# EAGLE design wcdl (EAGLE 9.6.2)
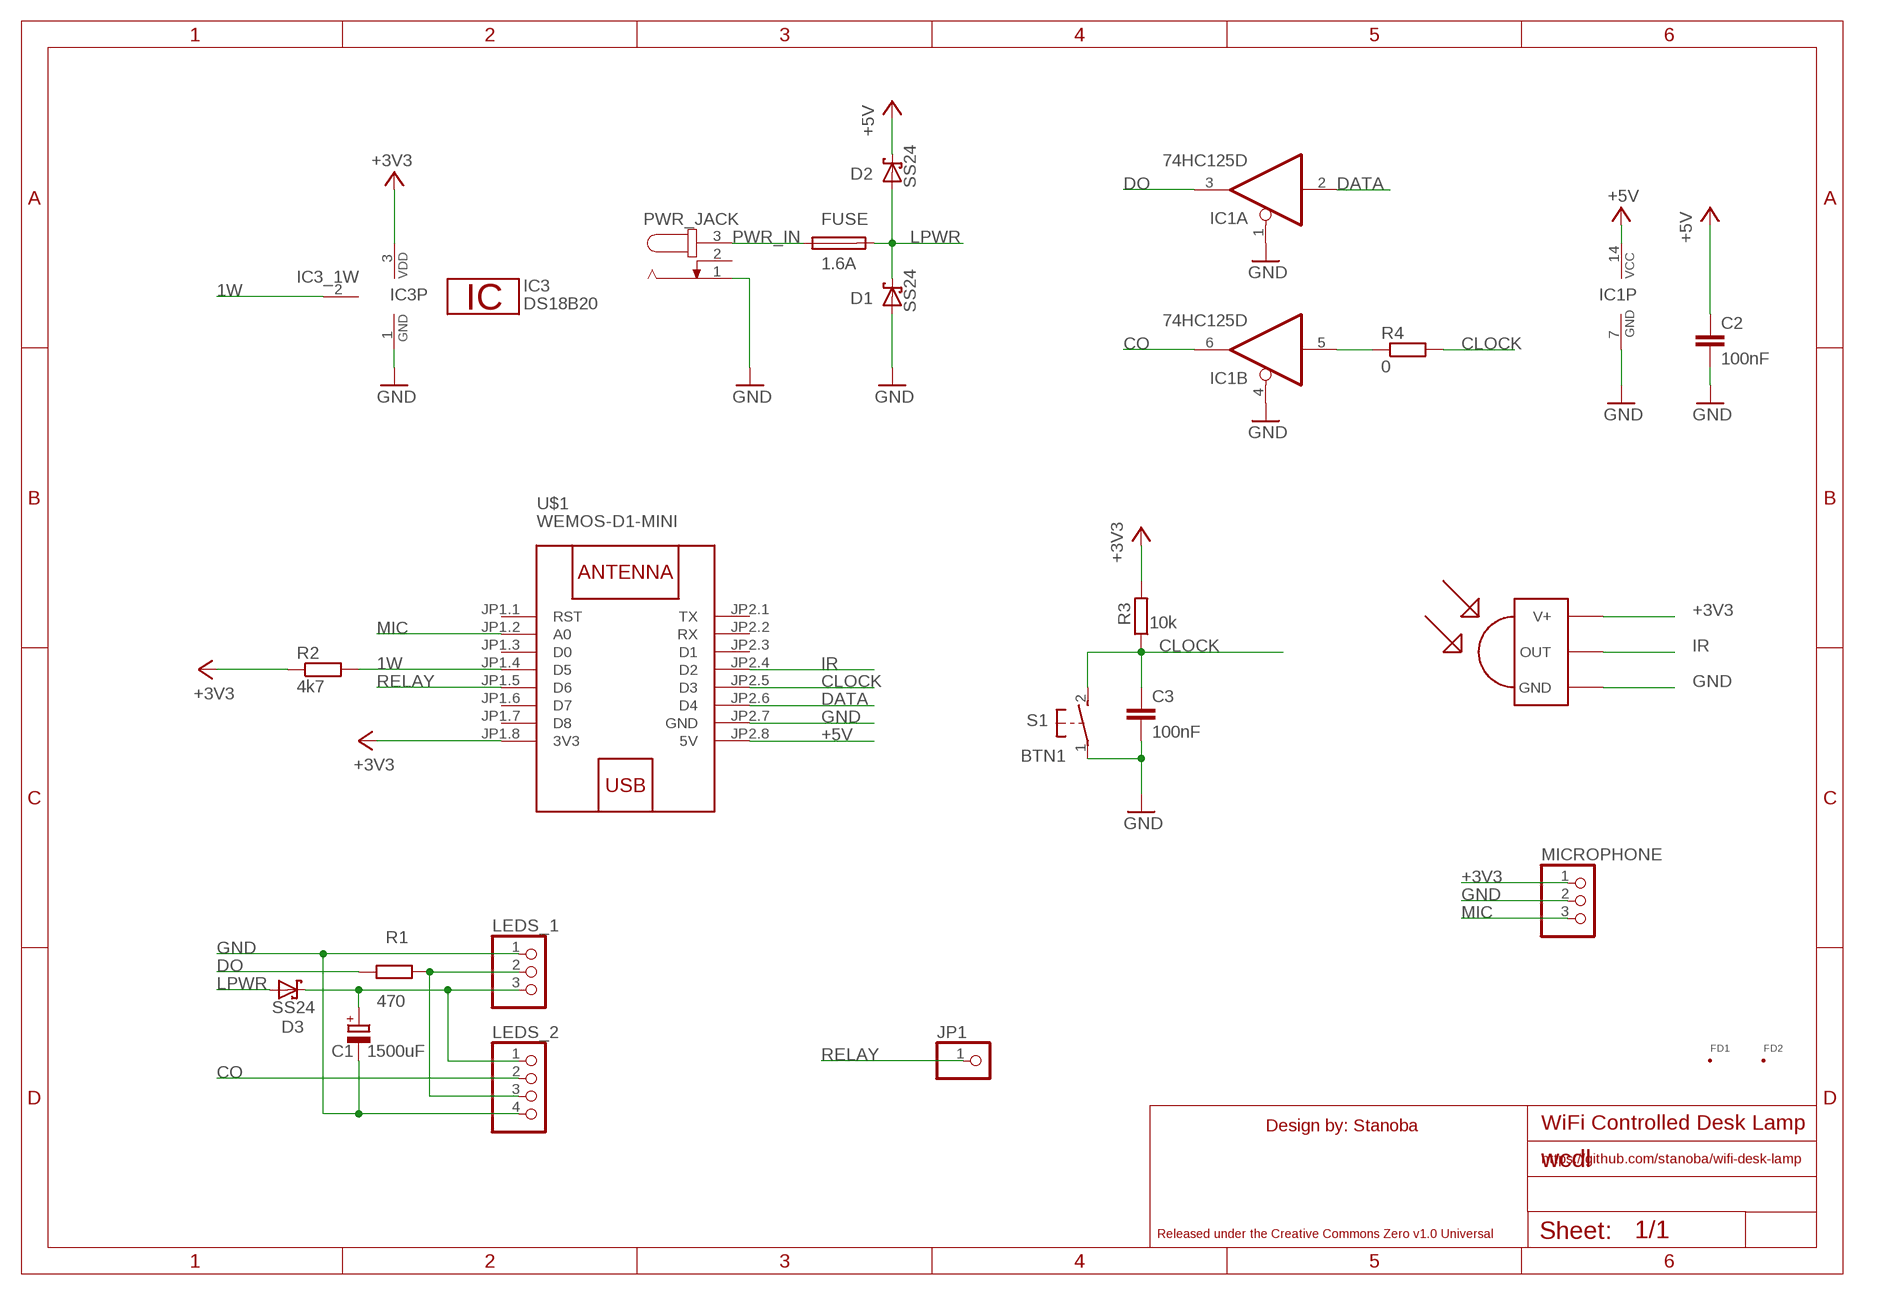
[diagram p0: schematic, sheet 1]

## Parts
C1  1500uF  CPOL-EUG  [PANASONIC_G]
C2  100nF  C-EUC0603  [C0603]
C3  100nF  C-EUC0603  [C0603]
D1  SS24  SCHOTTKY-DIODESMD  [SMB]
D2  SS24  SCHOTTKY-DIODESMD  [SMB]
D3  SS24  SCHOTTKY-DIODESMD  [SMB]
FD1  FID_40MIL  [FID_040]
FD2  FID_40MIL  [FID_040]
FUSE  1.6A  FUSESHK20L  [SHK20L]
IC1  74HC125D  [SO14]
IC3  DS18B20  [TO92-]
JP1  PINHD-1X1  [1X01]
LEDS_1  PINHD-1X3  [1X03]
LEDS_2  PINHD-1X4  [1X04]
MICROPHONE  PINHD-1X3  [1X03]
PWR_JACK  JACK-PLUG0  [SPC4077]
R1  470  R-EU_R0603  [R0603]
R2  4k7  R-EU_R0603  [R0603]
R3  10k  R-EU_R0603  [R0603]
R4  0  R-EU_R0402  [R0402]
S1  BTN1  31-XX  [B3F-31XX]
U$1  WEMOS-D1-MINI  [WEMOS-D1-MINI]
U$2  TSOP1838  [TSOP18XX]

## Nets
1W: IC3.2 R2.2 U$1.JP1.4(D5)
+3V3 [mid]: IC3.3 MICROPHONE.1 R2.1 R3.2 U$1.JP1.8(3V3) U$2.VCC(V+)
+5V [mid]: C2.1 D2.C IC1.14(P:VCC) U$1.JP2.8(5V)
CLOCK: C3.1 R3.1 R4.2 S1.2(S) U$1.JP2.5(D3)
CO: IC1.6(B:O) LEDS_2.2
DATA: IC1.2(A:I) U$1.JP2.6(D4)
DO: IC1.3(A:O) R1.1
GND [power]: C1.- C2.2 C3.2 D1.A IC1.1(A:OE) IC1.4(B:OE) IC1.7(P:GND) IC3.1 LEDS_1.1 LEDS_2.4 MICROPHONE.2 PWR_JACK.1 S1.1(P) U$1.JP2.7(GND) U$2.GND
IR: U$1.JP2.4(D2) U$2.OUT
LPWR [power]: D1.C D2.A D3.A FUSE.2A
MIC: MICROPHONE.3 U$1.JP1.2(A0)
N$1 [power]: C1.+ D3.C LEDS_1.3 LEDS_2.1
N$2: LEDS_1.2 LEDS_2.3 R1.2
N$3: IC1.5(B:I) R4.1
PWR_IN [power]: FUSE.1A PWR_JACK.3
RELAY: JP1.1 U$1.JP1.5(D6)
Unconnected: IC1.8(C:O) IC1.9(C:I) IC1.10(C:OE) IC1.11(D:O) IC1.12(D:I) IC1.13(D:OE) PWR_JACK.2 U$1.JP1.1(RST) U$1.JP1.3(D0) U$1.JP1.6(D7) U$1.JP1.7(D8) U$1.JP2.1(TX) U$1.JP2.2(RX) U$1.JP2.3(D1)

## Notes on the sheet
- Design by: Stanoba | WiFi Controlled Desk Lamp
- https://github.com/stanoba/wifi-desk-lamp
- Released under the Creative Commons Zero v1.0 Universal

## Library data of the parts
C1 = rcl:CPOL-EU: POLARIZED CAPACITOR, European symbol; SPICEPREFIX: C
C2 C3 = rcl:C-EU: CAPACITOR, European symbol; SPICEPREFIX: C
D1-D3 = _mod_diode:SCHOTTKY-DIODE: Schottky Diode
FD1 FD2 = Fiducial:FID: Fiducial marks. Top and Bottom copper with stop mask
FUSE = fuse:FUSE: Fuse; OC_FARNELL: unknown; OC_NEWARK: unknown
IC1 = 74xx-eu:74*125: Quad bus BUFFER, 3-state
IC3 = 1wire:DS18B20: Programmable Resolution Digital Thermometer This chip provides a onewire thermosensor with approx. 0.5°C accuracy. A programmable over/undertemperure alarm is available. The precision can be set from 9..12 bits. Notes: Vdd must be applied for accurate measurements at low temperatures, as the parasite power circuit otherwise heats the sensor. If parasite power is used, Vdd has to be connected to GND. The DS1822 is a low-cost thermometer chip, the DS18S20 is similar to the DS18B20, but with 9 Bit precision only. Author: Jan Kandziora <jjj@gmx.de>
JP1 = pinhead:PINHD-1X1: PIN HEADER
LEDS_1 MICROPHONE = pinhead:PINHD-1X3: PIN HEADER
LEDS_2 = pinhead:PINHD-1X4: PIN HEADER
PWR_JACK = con-jack:JACK-PLUG: DC POWER JACK Power Jack, DC, Right Angle, Through Hole, Rated 5A at 16VDC, PC Terminals Distributor: Farnell (www.Farnell.de) Drawing: 84N1161.pdf / 84N1162.pdf Manufacturer: SPC Technology (www.spctechnology.com) Type: SPC4077 / SPC 4078; OC_FARNELL: unknown; OC_NEWARK: unknown
R1-R4 = rcl:R-EU_: RESISTOR, European symbol; SPICEPREFIX: R
S1 = switch-omron:31-XX: OMRON SWITCH; MPN: B3F-3100; OC_FARNELL: 959704; OC_NEWARK: 36M3582
U$1 = diy-modules:WEMOS-D1-MINI: WEMOS D1 mini: Mini Wi-Fi Board based on ESP-8266 device More details can be found here: https://www.wemos.cc/product/d1-mini.html Click here to find device on ebay.com <http://www.ebay.com/sch/wemos+d1+mini+nodemcu>
U$2 = tsop:TSOP1838: IR Receiver and Demodulator

## Net classes
0 default: width 0.203 mm, clearance 0.203 mm
1 power: width 2.032 mm, clearance 0.254 mm
2 mid: width 0.406 mm, clearance 0.203 mm

## Board
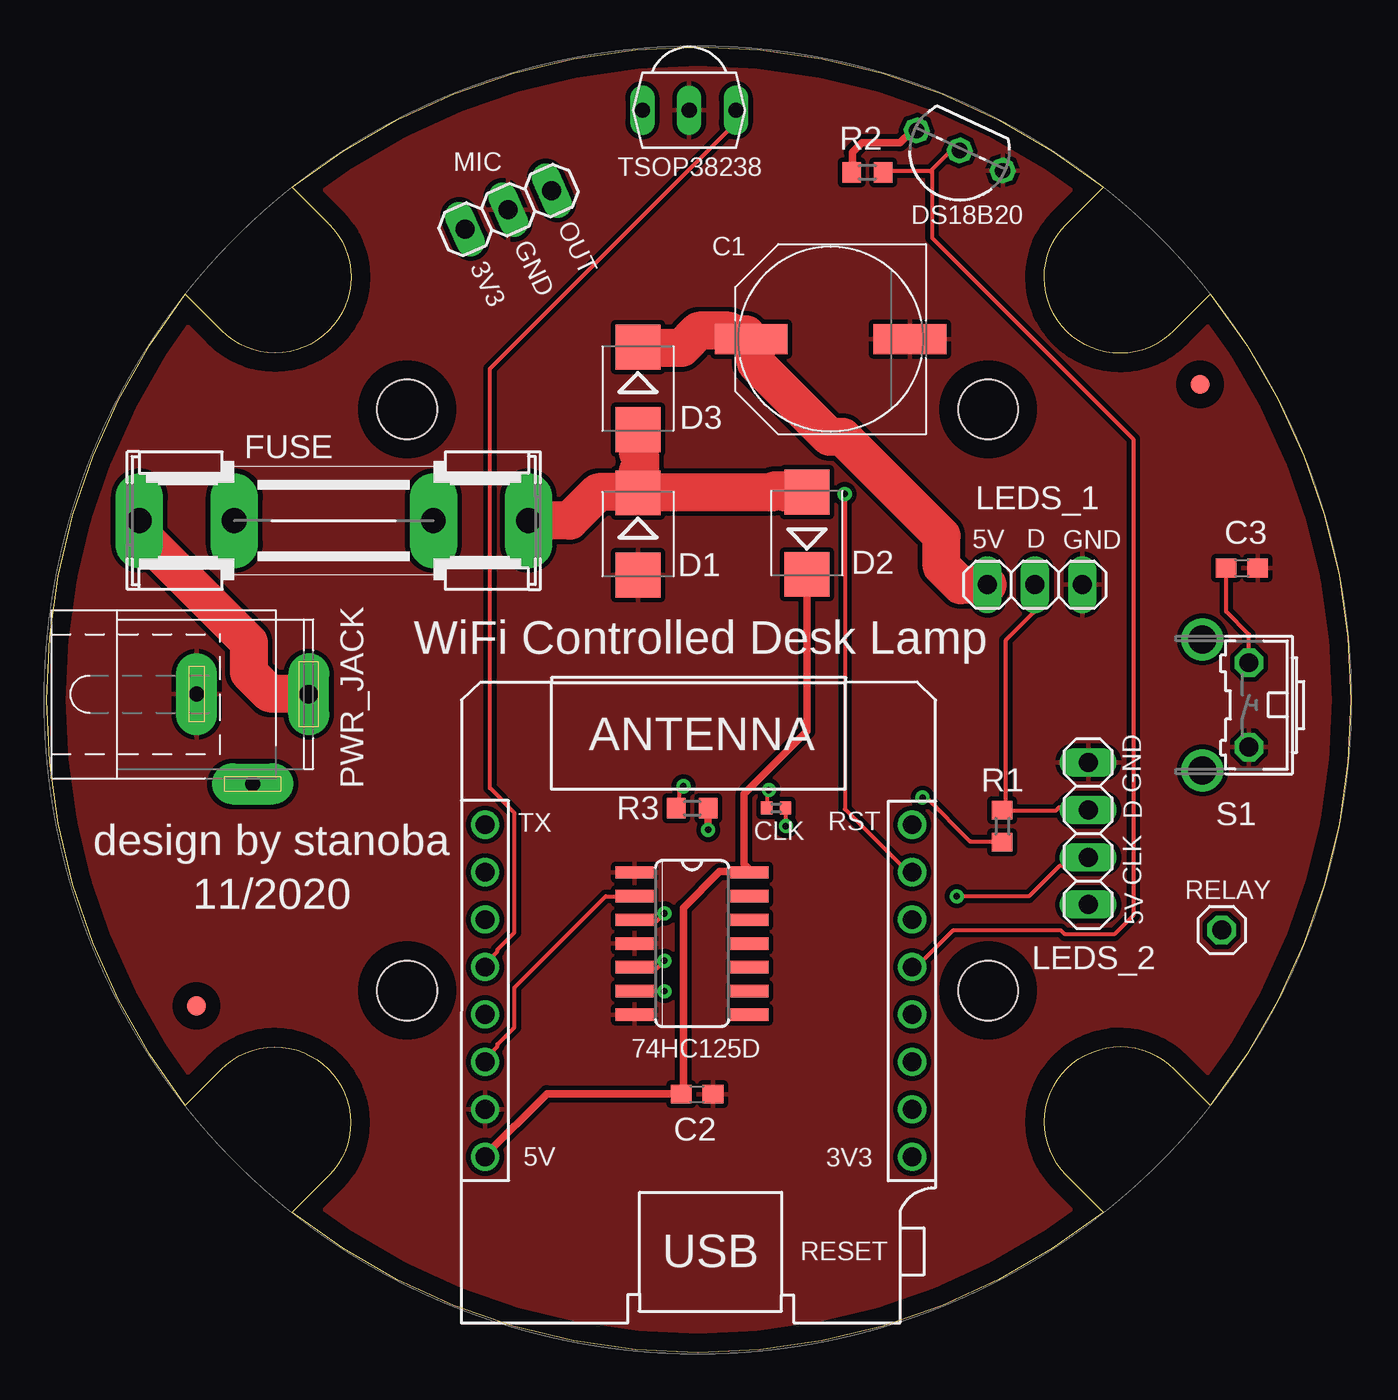
[diagram p1: board, top side]
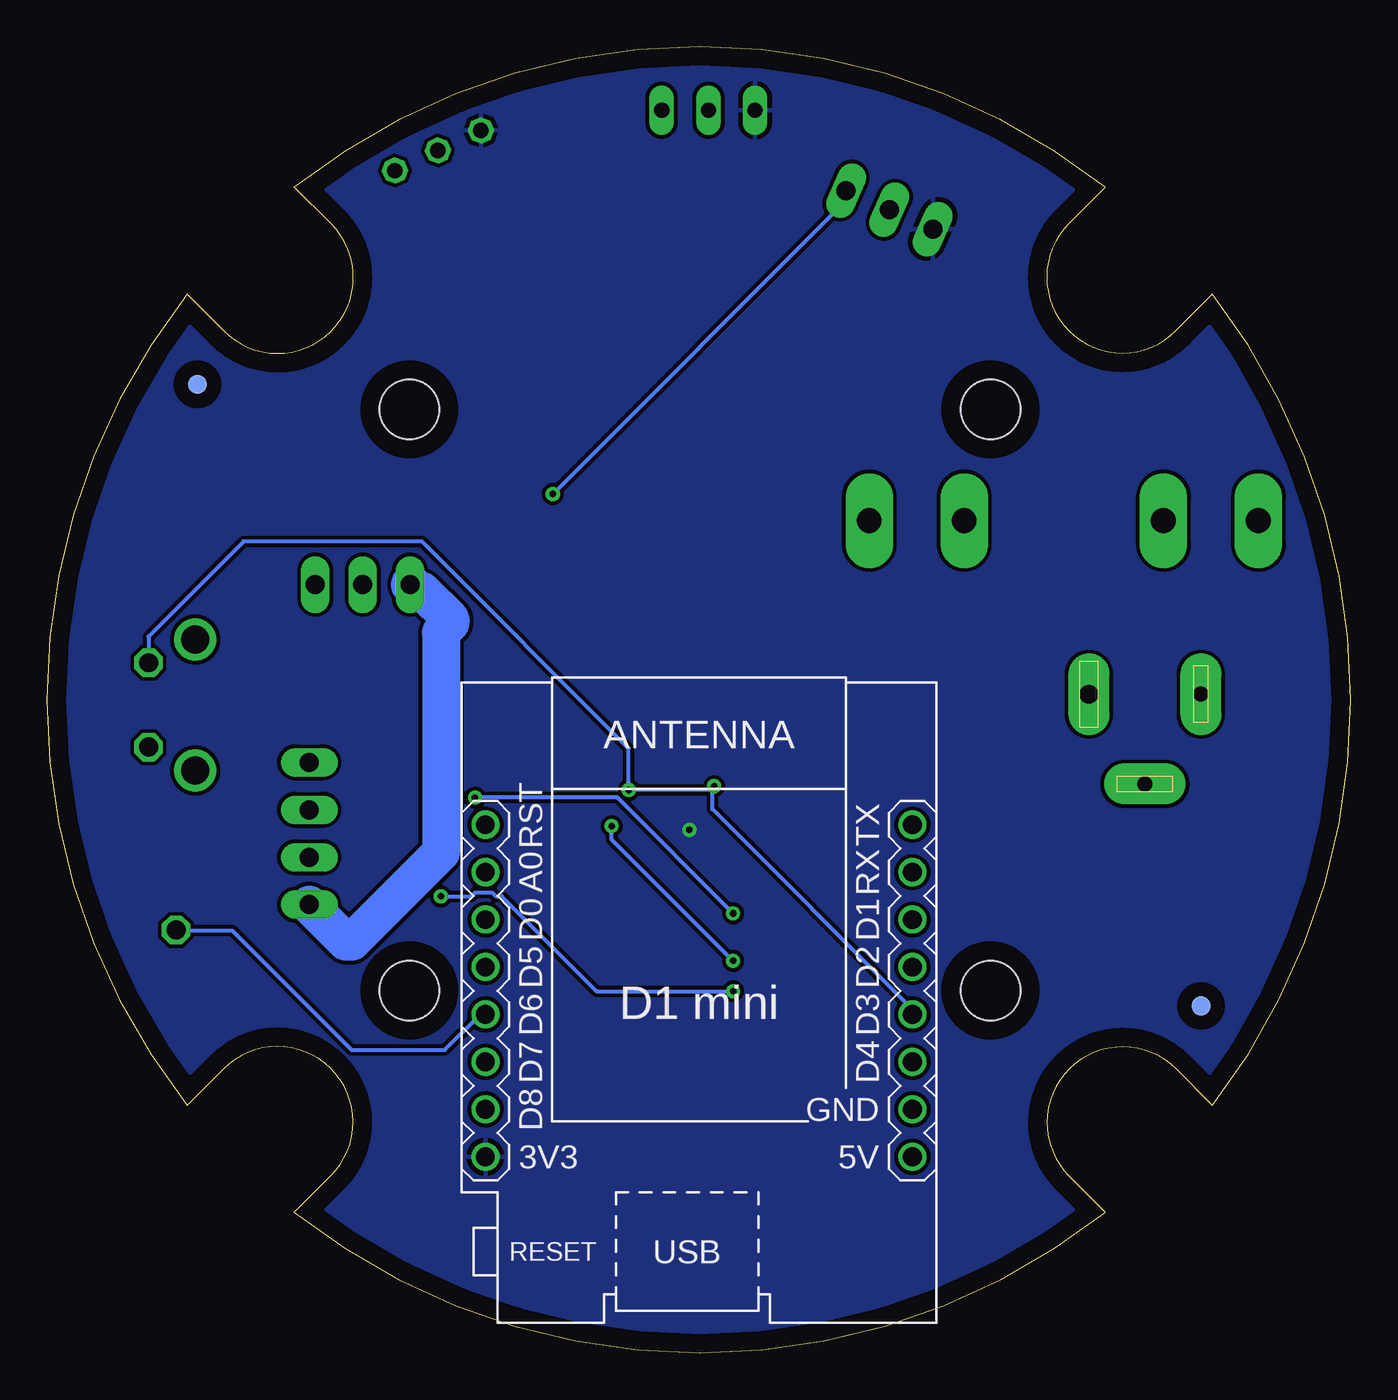
[diagram p2: board, bottom side, seen from below]

Size 69.82 x 69.93 mm. Coordinates in mm from the lower left corner, seen from the top.
Outline: 13.15,62.4 arc-76 56.57,62.4 54.58,60.42 arc180 60.35,54.71 62.3,56.67 arc-76 62.3,13.25 60.35,15.19 arc180 54.59,9.5 56.57,7.52 arc-76 13.15,7.52 15.09,9.46 arc180 9.33,15.18 7.42,13.25 arc-75 7.42,56.67 9.36,54.72 arc180 15.09,60.46 13.15,62.4
Copper layers (1*16): Top 0.035mm / dielectric 1.5mm / Bottom 0.035mm
Design rules "default": minimum track width 6mil, minimum drill 0.35mm, track to track 6mil, track to pad 6mil, pad to pad 6mil, via to via 6mil, smd to smd 6mil, copper to edge 40mil, drill to drill 6mil, minimum pad ring 10mil, minimum via ring 8mil, stop-mask expansion 4mil, vias tented up to drill 0mil, thermal gap 10mil
Holes 3.2 mm at 19.3,19.4 19.3,50.51 50.4,50.51 50.4,19.4

### Footprints (pad centres in the part's own frame; a part is rotated, then mirrored left to right if it is on the bottom)
PANASONIC_G = smd 3.9 x 1.6: + 4.25,0; - -4.25,0
C0603 = smd 1.1 x 1: 1 -0.85,0; 2 0.85,0
SMB = smd 2.4 x 2.4: A 2.2,0; C -2.2,0
FID_040 = smd 1.016 x 1.016 bottom: FIDB 0,0 | smd 1.016 x 1.016: FIDT 0,0
SHK20L = drill 1.321 pad 2.54 long: 1A -10.414,0; 1B -5.334,0; 2A 10.414,0; 2B 5.334,0
SO14 = smd 0.66 x 2.032: 1 -3.81,-3.073; 2 -2.54,-3.073; 3 -1.27,-3.073; 4 0,-3.073; 5 1.27,-3.073; 6 2.54,-3.073; 7 3.81,-3.073; 8 3.81,3.073; 9 2.54,3.073; 10 1.27,3.073; 11 0,3.073; 12 -1.27,3.073; 13 -2.54,3.073; 14 -3.81,3.073
TO92- = drill 0.813 octagon: 1 -2.54,0; 2 0,0; 3 2.54,0
1X01 = drill 1.016 octagon: 1 0,0
1X03 = drill 1.016 long: 1 -2.54,0; 2 0,0; 3 2.54,0
1X04 = drill 1.016 long: 1 -3.81,0; 2 -1.27,0; 3 1.27,0; 4 3.81,0
SPC4077 = drill 0.8 pad 2.184 long: 1 -3,0; 2 0,-4.8 | drill 1 pad 2.184 long: 3 3,0
R0603 = smd 1 x 1.1: 1 -0.85,0; 2 0.85,0
R0402 = smd 0.6 x 0.7: 1 -0.5,0; 2 0.5,0
B3F-31XX = drill 1.016 octagon: 1 -2.261,-1.245; 2 2.261,-1.245 | drill 1.499 pad 2.159: 3 -3.505,1.245; 4 3.505,1.245
WEMOS-D1-MINI = drill 1: JP1.1 -11.43,9.525; JP1.2 -11.43,6.985; JP1.3 -11.43,4.445; JP1.4 -11.43,1.905; JP1.5 -11.43,-0.635; JP1.6 -11.43,-3.175; JP1.7 -11.43,-5.715; JP1.8 -11.43,-8.255; JP2.1 11.43,9.525; JP2.2 11.43,6.985; JP2.3 11.43,4.445; JP2.4 11.43,1.905; JP2.5 11.43,-0.635; JP2.6 11.43,-3.175; JP2.7 11.43,-5.715; JP2.8 11.43,-8.255
TSOP18XX = drill 0.813 long: GND -0.001,-0.027; OUT -2.501,-0.027; VCC 2.499,-0.027

### Placement (x,y rotation side)
C1  41.97,54.26 180 top
C2  34.82,13.84 0 top
C3  63.98,42.01 0 top
D1  31.66,43.84 270 top
D2  40.7,43.88 90 top
D3  31.65,51.63 270 top
FD1  8.01,18.57 0 top
FD2  61.75,51.85 0 top
FUSE  15.37,44.55 0 top
IC1  34.55,21.91 270 top
IC3  48.88,64.37 155 top
JP1  62.9,22.63 0 top
LEDS_1  52.91,41.13 180 top
LEDS_2  55.76,27.8 90 top
MICROPHONE  24.71,61.19 24 top
PWR_JACK  11.03,35.26 0 top
R1  51.16,28.19 90 top
R2  43.94,63.19 0 top
R3  34.56,29.15 0 top
R4  39.05,29.17 180 top
S1  63.12,34.68 90 top
U$1  34.9,18.75 0 bottom
U$2  34.4,66.5 180 top

### Tracks (layer width: path | path; a pad name or v marks a point on that pad's centre or on a via)
1W
  Top 0.203: 47.35,63.3 48.42,64.37 48.82,64.37 IC3.2 | 47.35,63.3 47.3,63.25 44.86,63.25 R2.2 | U$1.JP1.4 46.38,20.68 46.59,20.68 48.52,22.61 54.31,22.61 54.51,22.41 57.15,22.41 58.17,23.42 58.17,48.92 47.4,59.69 47.4,63.25 47.35,63.3
+3V3  (via drill 0.35)
  Top 0.406: v35.41,28 R3.2 | R2.1 43.13,63.25 43.13,64.27 43.64,64.77 45.67,64.77 46.28,65.38 46.49,65.38 IC3.3
  pour Bottom: 34.24,70.02 arc90 -0.15,35.44 arc90 35.15,-0.05 arc90 70,34.76 arc90
+5V
  Top 0.406: U$1.JP2.8 23.42,10.52 26.78,13.87 33.89,13.87 C2.1 34.09,13.97 34.09,23.83 36.02,25.76 37.55,25.76 IC1.14 37.55,25.96 37.34,26.17 37.34,29.93 40.69,33.28 40.69,41.61 D2.C
CLOCK  (via drill 0.35)
  Top 0.203: C3.1 63.15,41.91 63.15,39.68 64.37,38.46 64.37,37.04 S1.2 | v38.66,30.13 38.56,30.03 38.56,29.21 R4.2 | v34.09,30.33 33.89,30.13 33.89,29.32 33.79,29.21 R3.1
  Bottom 0.203: U$1.JP2.5 23.52,18.14 23.52,18.44 34.19,29.11 34.19,30.13 v34.09,30.33 34.29,30.13 v38.66,30.13 38.66,32.36 49.74,43.44 59.29,43.44 64.37,38.36 64.37,37.04 S1.2
CO  (via drill 0.35)
  Top 0.203: v33.07,19.36 31.55,19.36 IC1.6 | v48.72,24.44 52.58,24.44 54.21,26.06 54.41,26.06 54.82,26.47 55.73,26.47 LEDS_2.2
  Bottom 0.203: v33.07,19.36 40.39,19.36 45.47,24.44 45.77,24.44 45.98,24.64 46.89,24.64 47.1,24.44 v48.72,24.44
DATA
  Top 0.203: IC1.2 31.45,24.44 29.93,24.44 25.05,19.56 25.05,17.43 24.13,16.51 24.13,16.41 23.52,15.8 23.52,15.6 U$1.JP2.6
DO  (via drill 0.35)
  Top 0.203: v46.89,29.72 47.1,29.72 49.43,27.39 51.16,27.39 R1.1 | v33.07,23.52 32.67,23.12 31.55,23.12 IC1.3
  Bottom 0.203: v46.89,29.72 39.27,29.72 v33.07,23.52
GND
  pour Top: 34.39,70.21 arc90 0.3,34.9 arc90 35.03,-0.14 arc90 69.85,35.08 arc90
IR
  Top 0.203: U$2.OUT 36.83,66.5 36.83,65.79 23.73,52.68 23.73,30.23 25.05,28.91 25.05,22.51 24.13,21.59 24.13,21.49 23.52,20.88 23.52,20.68 U$1.JP2.4
LPWR
  Top 2.032: D1.C 31.65,46.08 31.65,47.2 31.75,47.3 31.75,48.11 31.65,48.21 D3.A | D2.A 39.48,46.08 39.37,46.18 38.97,46.18 38.87,46.08 32.67,46.08 D1.C | FUSE.2A 25.86,44.56 27.99,44.56 29.52,46.08 30.64,46.08 D1.C
MIC  (via drill 0.35)
  Top 0.203: v42.73,45.98 42.73,29.11 46.08,25.76 46.28,25.76 U$1.JP1.2
  Bottom 0.203: v42.73,45.98 27.08,61.62 27.08,62.13 MICROPHONE.3
N$1
  Top 2.032: D3.C 31.65,53.8 33.99,53.8 34.9,54.72 36.53,54.72 36.73,54.51 37.44,54.51 37.65,54.31 C1.+ 37.95,53.29 37.95,52.99 41.91,49.03 42.63,49.03 47.91,43.74 47.91,42.12 48.92,41.1 50.04,41.1 50.14,41.2 50.25,41.1 50.35,41.1 LEDS_1.3
  Bottom 2.032: LEDS_2.1 55.73,23.93 53.8,22 53.5,22 48.72,26.78 48.72,38.56 48.21,39.07 48.21,39.27 49.74,40.8 49.94,40.8 50.35,41.2 LEDS_1.3
N$2
  Top 0.203: 51.36,29.01 54,29.01 54.21,29.21 54.31,29.11 55.73,29.11 LEDS_2.3 | 51.36,29.01 51.26,29.01 R1.2 51.36,29.01 | 51.36,29.01 51.36,38.16 52.89,39.68 52.89,41.1 LEDS_1.2
N$3  (via drill 0.35)
  Top 0.203: v39.58,28.2 39.58,29.11 R4.1 | v33.07,20.98 32.67,20.58 31.55,20.58 IC1.5
  Bottom 0.203: v39.58,28.2 39.58,27.49 v33.07,20.98
PWR_IN
  Top 2.032: PWR_JACK.3 13.97,35.31 11.94,35.31 10.82,36.43 10.82,38.05 5.03,43.84 5.03,44.45 FUSE.1A
RELAY
  Bottom 0.203: U$1.JP1.5 46.38,18.04 46.69,18.04 48.52,16.21 53.5,16.21 59.9,22.61 62.84,22.61 JP1.1

### Text on the board
tPlace: MIC | TSOP38238 | OUT | DS18B20 | GND | 3V3 | 5V | D | GND | WiFi Controlled Desk Lamp | GND | ANTENNA | D | TX | RST | CLK | design by stanoba | CLK | 5V | 11/2020 | RELAY | 74HC125D | 5V | 3V3 | USB | RESET